# Altium schematic sheet ПЕР_ПЛАТА.SchDoc
size A4
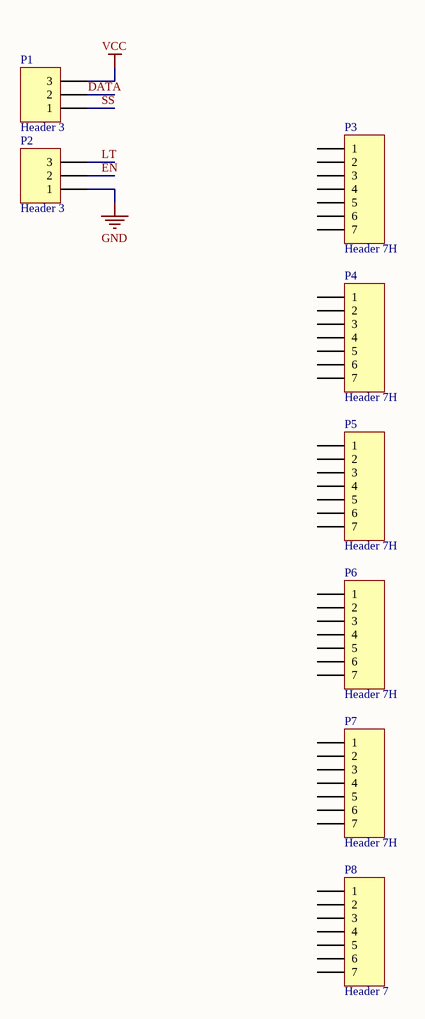
[diagram p0: ПЕР_ПЛАТА.SchDoc]

## Parts
P1  Header 3  [HDR1X3]
P2  Header 3  [HDR1X3]
P3  Header 7H  [HDR1X7H]
P4  Header 7H  [HDR1X7H]
P5  Header 7H  [HDR1X7H]
P6  Header 7H  [HDR1X7H]
P7  Header 7H  [HDR1X7H]
P8  Header 7  [HDR1X7]

## Nets
GND: P2.1
VCC: P1.3
DATA: P1.2
EN: P2.2
LT: P2.3
SS: P1.1

Not connected (* = marked no-connect by the designer): P3 1 2 3 4 5 6 7; P4 1 2 3 4 5 6 7; P5 1 2 3 4 5 6 7; P6 1 2 3 4 5 6 7; P7 1 2 3 4 5 6 7; P8 1 2 3 4 5 6 7

## Library data of the parts
P1 P2 = Header 3: Header, 3-Pin; LatestRevisionDate: 17-Jul-2002; LatestRevisionNote: Re-released for DXP Platform.; Publisher: Altium Limited
P3-P7 = Header 7H: Header, 7-Pin, Right Angle; LatestRevisionDate: 17-Jul-2002; LatestRevisionNote: Re-released for DXP Platform.; Publisher: Altium Limited
P8 = Header 7: Header, 7-Pin; LatestRevisionDate: 17-Jul-2002; LatestRevisionNote: Re-released for DXP Platform.; Publisher: Altium Limited